# Altium schematic sheet VerticalPCBConnection.SchDoc
size Letter; CompanyName: PloopyCo; Organization: Ploopy Co; Address1: 137-1140 Burnhamthorpe Road W; Address2: Mississauga; Address3: Ontario; Address4: Canada L5C 0A3; DocumentNumber: 8; Revision: R1.004; SheetNumber: 8; SheetTotal: 8
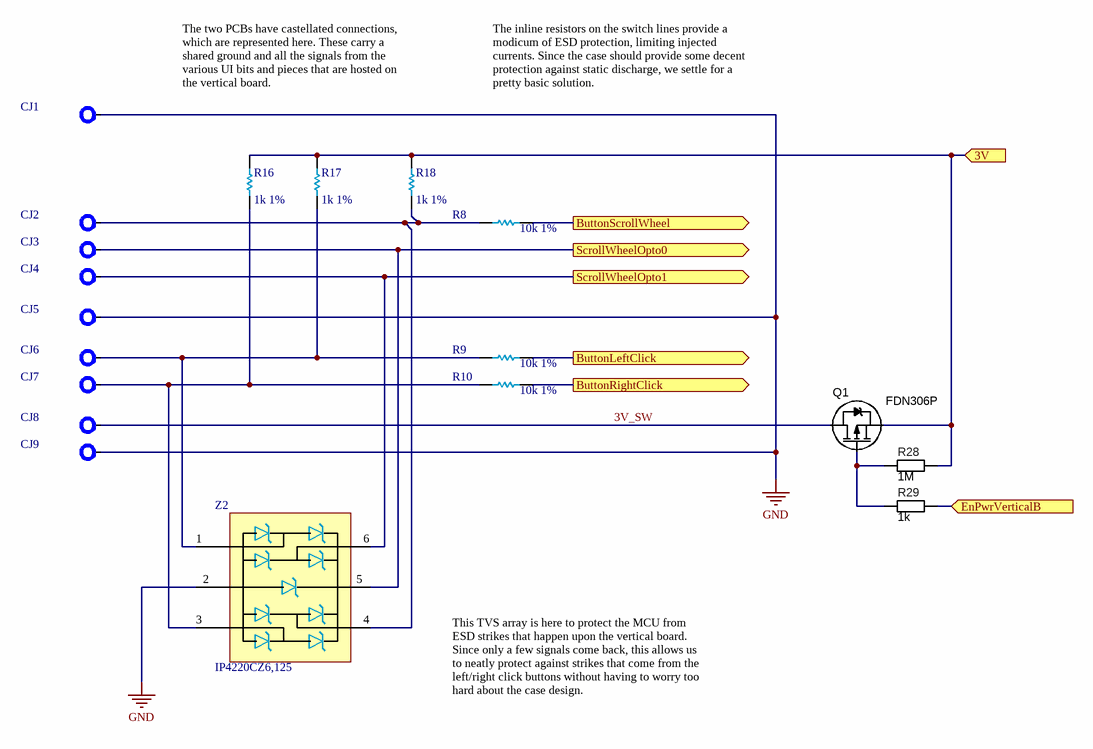
[diagram p0: VerticalPCBConnection.SchDoc]

## Parts
CJ1  PCBJointCastellationJoint  [PCBJoint]  (value not drawn)  (no BOM)
CJ2  PCBJointCastellationJoint  [PCBJoint]  (value not drawn)  (no BOM)
CJ3  PCBJointCastellationJoint  [PCBJoint]  (value not drawn)  (no BOM)
CJ4  PCBJointCastellationJoint  [PCBJoint]  (value not drawn)  (no BOM)
CJ5  PCBJointCastellationJoint  [PCBJoint]  (value not drawn)  (no BOM)
CJ6  PCBJointCastellationJoint  [PCBJoint]  (value not drawn)  (no BOM)
CJ7  PCBJointCastellationJoint  [PCBJoint]  (value not drawn)  (no BOM)
CJ8  PCBJointCastellationJoint  [PCBJoint]  (value not drawn)  (no BOM)
CJ9  PCBJointCastellationJoint  [PCBJoint]  (value not drawn)  (no BOM)
Q1  FDN306P  [SOT23-3]
R8  value 10k 1%  [R0603]  (hidden comment: 0805)
R9  value 10k 1%  [R0603]  (hidden comment: 0805)
R10  value 10k 1%  [R0603]  (hidden comment: 0805)
R16  value 1k 1%  [R0603]  (hidden comment: 0805)
R17  value 1k 1%  [R0603]  (hidden comment: 0805)
R18  value 1k 1%  [R0603]  (hidden comment: 0805)
R28  1M  [R0603]
R29  1k  [R0603]
Z2  IP4220CZ6,125  [PESD3V3S4UD - SOT95P275X110-6N]

## Ports
3V (in), ButtonLeftClick (out), ButtonRightClick (out), ButtonScrollWheel (out), EnPwrVerticalB (in), ScrollWheelOpto0 (out), ScrollWheelOpto1 (out)

## Nets
GND: CJ1.1 CJ5.1 CJ9.1 Z2.2
3V: Q1.2(S) R16.2 R17.2 R18.2 R28.2 ; port 3V
3V_SW: CJ8.1 Q1.3(D)
ButtonLeftClick: R9.2 ; port ButtonLeftClick
ButtonRightClick: R10.2 ; port ButtonRightClick
ButtonScrollWheel: R8.2 ; port ButtonScrollWheel
EnPwrVerticalB: R29.2 ; port EnPwrVerticalB
ScrollWheelOpto0: CJ3.1 Z2.5 ; port ScrollWheelOpto0
ScrollWheelOpto1: CJ4.1 Z2.6 ; port ScrollWheelOpto1
NetCJ2_1: CJ2.1 R8.1 R18.1 Z2.4
NetCJ6_1: CJ6.1 R9.1 R17.1 Z2.1
NetCJ7_1: CJ7.1 R10.1 R16.1 Z2.3
NetQ1_1: Q1.1(G) R28.1 R29.1

## Notes on the sheet
- The two PCBs have castellated connections, which are represented here. These carry a shared ground and all the signals from the various UI bits and pieces that are hosted on the vertical board.
- The inline resistors on the switch lines provide a modicum of ESD protection, limiting injected currents. Since the case should provide some decent protection against static discharge, we settle for a pretty basic solution.
- This TVS array is here to protect the MCU from ESD strikes that happen upon the vertical board. Since only a few signals come back, this allows us to neatly protect against strikes that come from the left/right click buttons without having to worry too hard about the case design.
- Copyright Ploopy Corporation 2019
- Licensed under the CERN OHL v. 1.2
- http://ohwr.org/cernohl
- Title:
- PCB:
- Version:
- Ploopy Corporation
- Mississauga ON L5C 0A3
- 137-1140 Burnhamthorpe Road W
- Date:
- Time:
- Sheet
- of
- Canada

## Library data of the parts
CJ1-CJ9 = PCBJoint: Pad for soldering a castellated PCB edge. Easy way to join two PCBs together.; PNP-Nzl: 2; PNP-dx: 0; PNP-X: 1; PNP-TS: 70; PNP-Type: CHI; PNP-FeedType: Tape; PNP-TapeWidth: 8; PNP-dy: 0; PNP-Y: 1; PNP-A: 0; PNP-Pt: 0; PNP-W: 0; PNP-Thk: 1; PNP-Lv: 1; PNP-Level: 1; PNP-Voff: 0; PNP-PlacePriority: 1; PNP-TapeIndex: 1; PNP-da: 0
Q1 = MOS_P_PMV75UP: 20 V, P-channel, 90mOhm @ 3V3
R8-R10 = Res 10k 1% 0805: Chip resistor; PNP-Nzl: 2; PNP-dx: 0; PNP-X: 2.00; PNP-Y: 1.25; PNP-Thk: 0.55; PNP-Lv: 1; PNP-TS: 70; PNP-Type: chi; PNP-FeedType: Tape; PNP-TapeWidth: 8; Supplier 1: Digi-Key; Supplier Part Number 1: RMCF0805FT10K0TR-ND; PNP-dy: 0; PNP-Pt: 0; PNP-W: 0; PNP-Level: 1; PNP-Voff: 0; PNP-PlacePriority: 1; PNP-A: 0; PNP-TapeIndex: 1; PNP-da: 0
R16-R18 = Res 1k 1% 0805: Chip resistor, 1/8W 100PPM; PNP-Nzl: 2; PNP-dx: 0; PNP-X: 2.00; PNP-Y: 1.25; PNP-Thk: 0.55; PNP-Lv: 1; PNP-TS: 70; PNP-Type: chi; PNP-FeedType: Tape; PNP-TapeWidth: 8; Supplier 1: Digi-Key; Supplier Part Number 1: RMCF0805FT1K00TR-ND; PNP-dy: 0; PNP-Pt: 0; PNP-W: 0; PNP-Level: 1; PNP-Voff: 0; PNP-PlacePriority: 1; PNP-A: 0; PNP-TapeIndex: 1; PNP-da: 0
R28 R29 = R0603: Generic 0603 resistor footprint
Z2 = IP4220CZ6,125: TVS DIODE 5.5V 6TSOP (Low capacitance, USB); PNP-Nzl: 2; PNP-dx: 0; PNP-X: 2.9; PNP-Y: 1.3; PNP-A: 270; PNP-Thk: 1; PNP-Lv: 26; PNP-TS: 90; PNP-Type: CHP; PNP-FeedType: Tape; PNP-TapeWidth: 8; PNP-PlacePriority: 3; PNP-dy: 0; PNP-Pt: 0; PNP-W: 0; PNP-Level: 1; PNP-Voff: 0; PNP-TapeIndex: 1; PNP-da: 0; Supplier 1: Digi-Key; Supplier 2: Mouser; Supplier 3: Arrow; Supplier Part Number 1: 1727-3578-1-ND; Supplier Part Number 2: 771-IP4220CZ6-T/R; Supplier Part Number 3: IP4220CZ6,125